# Altium schematic sheet АСТА.425543.043 Э3 Лист1.SchDoc
size 420 x 297 mm; Revision: 1; PageSetup: Record=PageOptions|CenterHorizontal=True|CenterVertical=True|PrintScale=0.96|XCorrection=1.00|YCorrection=1.00|PrintKind=1|BorderSize=5000000|LeftOffset=0|BottomOffset=0|Orientation=2|PaperLength=1000|PaperWidth=1000|Scale=100|PaperSource=7|PrintQuality=-4|MediaType=1|DitherType=10|PaperKind=A3|PrintScaleMode=1
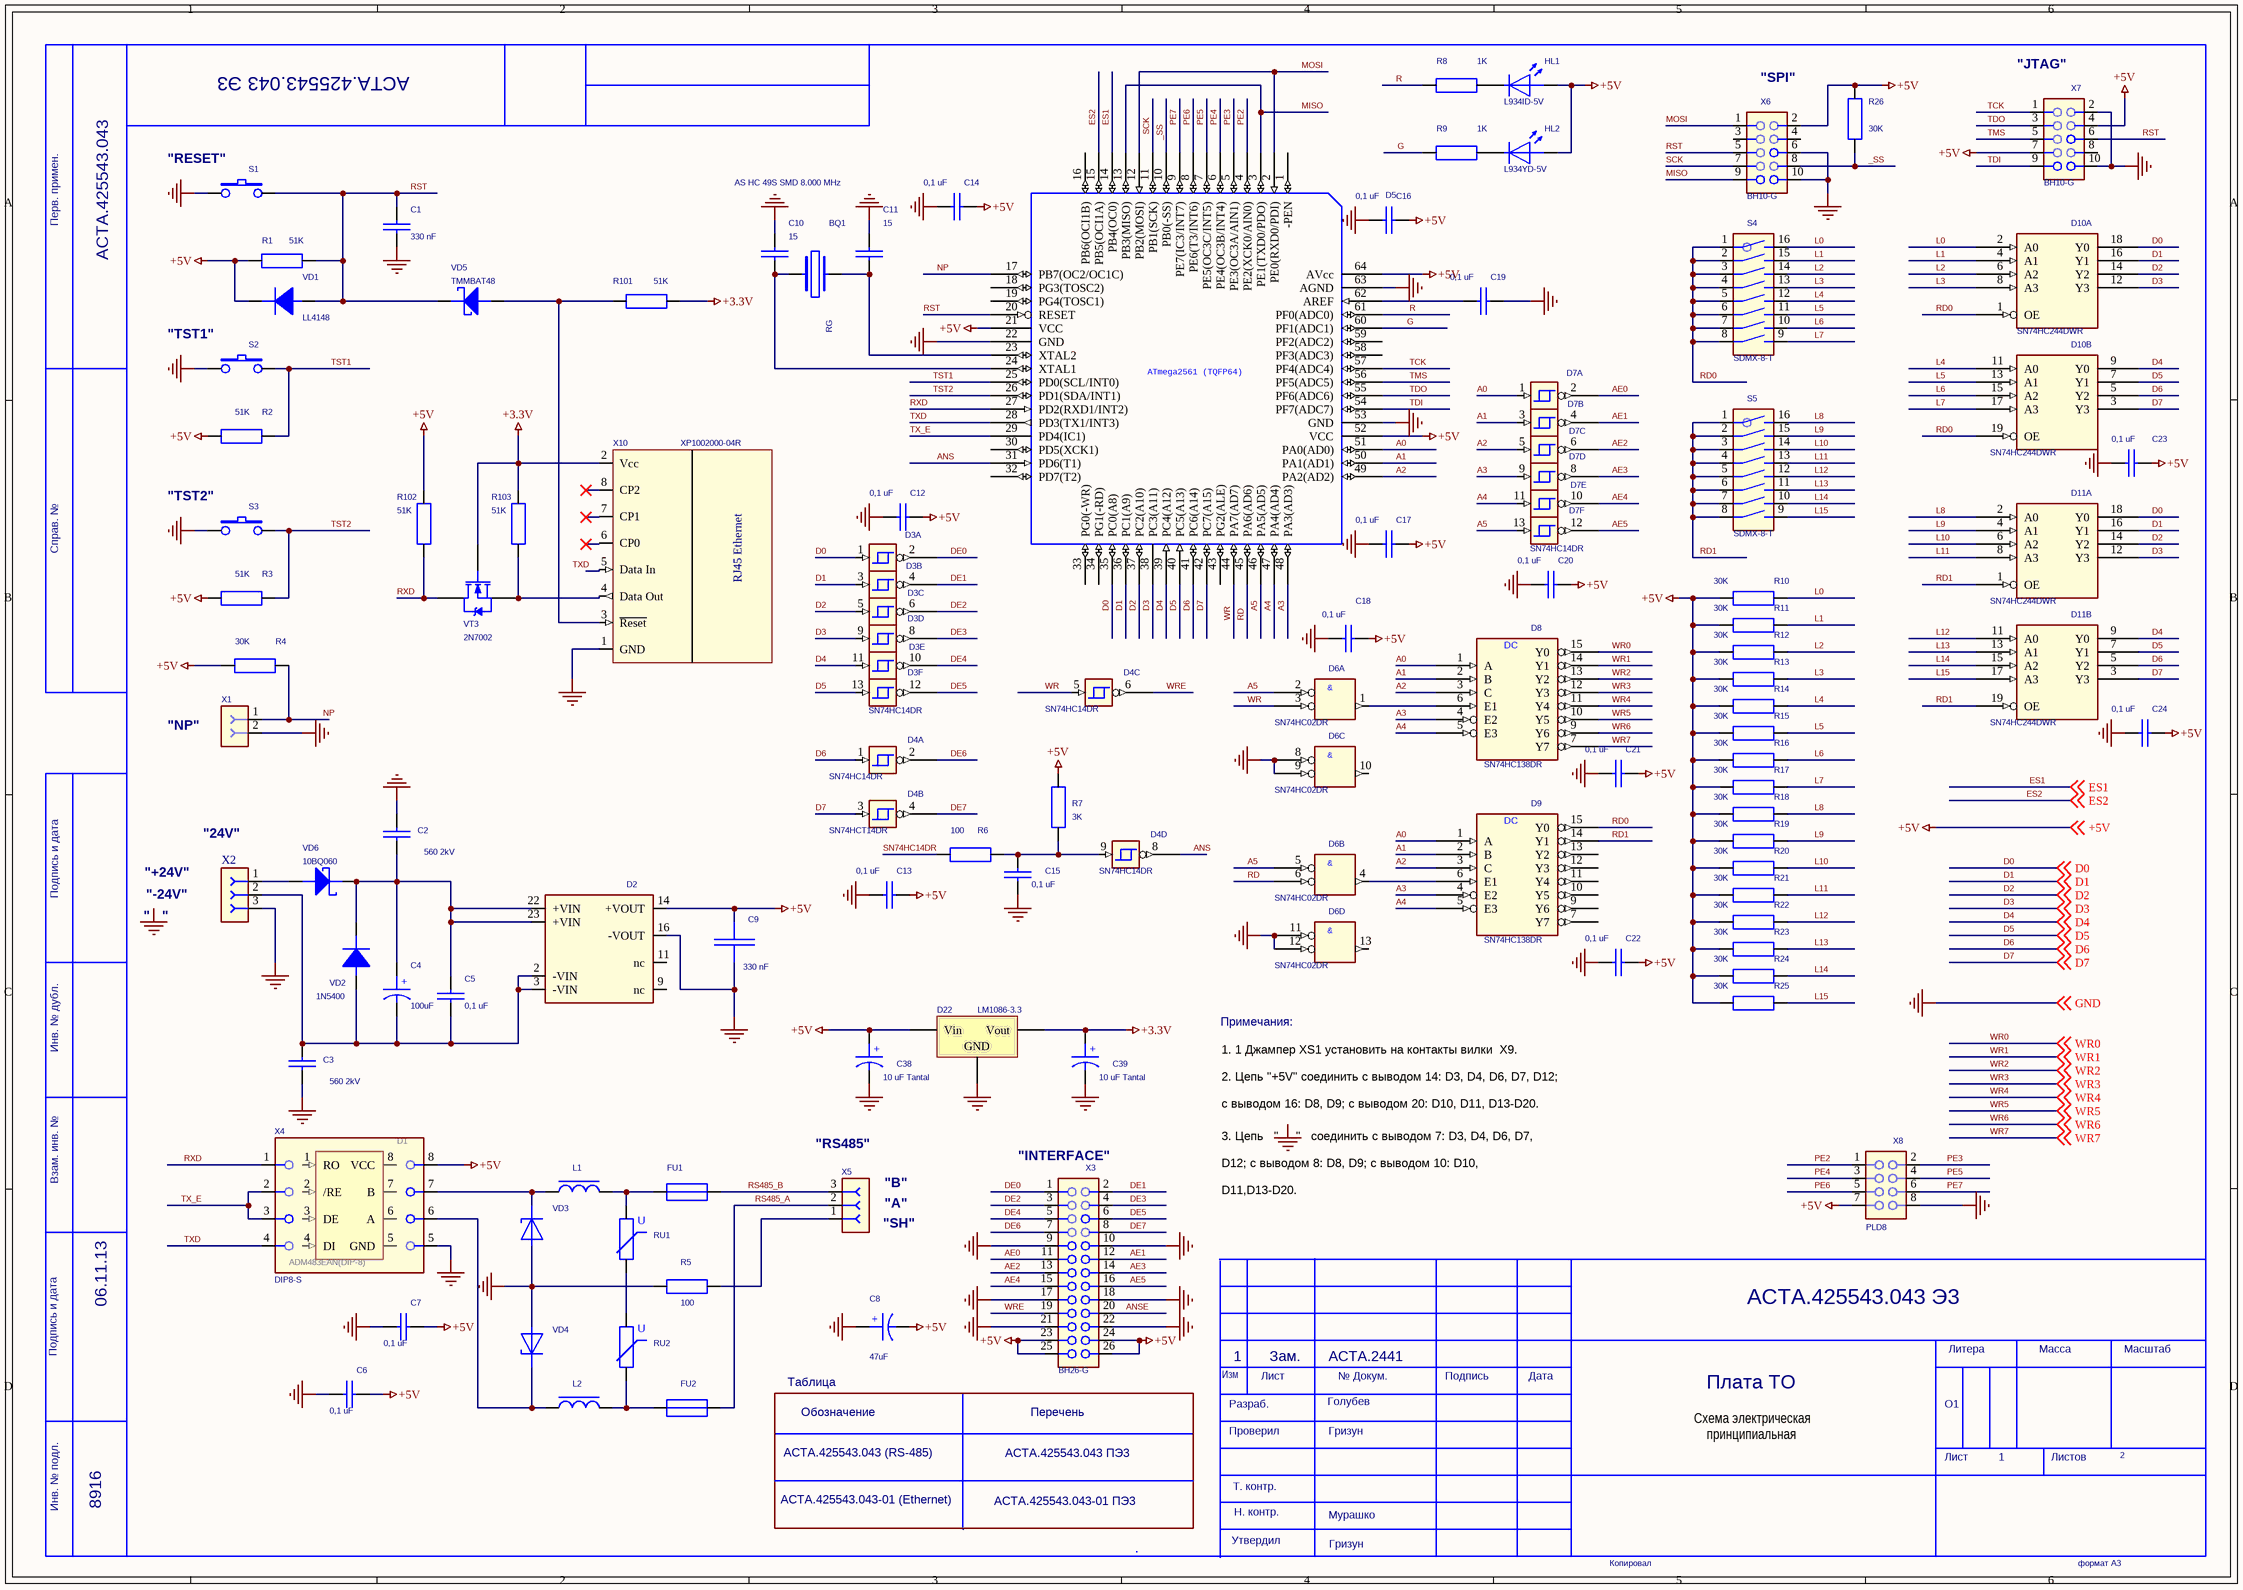
[diagram p0: АСТА.425543.043 Э3 Лист1.SchDoc]

## Parts
BQ1  AS HC 49S SMD 8.000 MHz  TYP: RG  [RG05.PRT]
C1  330 nF  [1206.PRT]
C2  560 2kV  [1206.PRT]
C3  560 2kV  [1206.PRT]
C4  100uF
C5  0,1 uF  [1206.PRT]
C6  0,1 uF  [1206.PRT]
C7  0,1 uF  [1206.PRT]
C8  47uF
C9  330 nF
C10  15  [1206.PRT]
C11  15  [1206.PRT]
C12  0,1 uF  [1206.PRT]
C13  0,1 uF  [1206.PRT]
C14  0,1 uF  [1206.PRT]
C15  0,1 uF  [1206.PRT]
C16  0,1 uF  [1206.PRT]
C17  0,1 uF  [1206.PRT]
C18  0,1 uF  [1206.PRT]
C19  0,1 uF  [1206.PRT]
C20  0,1 uF  [1206.PRT]
C21  0,1 uF  [1206.PRT]
C22  0,1 uF  [1206.PRT]
C23  0,1 uF  [1206.PRT]
C24  0,1 uF  [1206.PRT]
C38  10 uF Tantal
C39  10 uF Tantal
D1  ADM483EAN(DIP-8)  [DIP8.PRT]
D2  AM8T-2405SC  (value not drawn)
D3  SN74HCT14DR  (value not drawn)  (parts A,B,C,D,E,F of 6)
D4  SN74HC14DR  (parts A,B,C,D of 6)
D5  ATmega2561 (TQFP64)  [DIP40.PRT]  (value not drawn)
D6  SN74HC02DR  (parts A,B,C,D of 4)
D7  SN74HCT14DR  (value not drawn)  (parts A,B,C,D,E,F of 6)
D8  SN74HC138DR
D9  SN74HC138DR
D10  SN74HC244DWR  (parts A,B of 2)
D11  SN74HC244DWR  (parts A,B of 2)
D22  LM1086-3.3  [D2PAK_N]
FU1  TR5 Fast 0,2A  [FUSE.PRT]  (value not drawn)
FU2  TR5 Fast 0,2A  [FUSE.PRT]  (value not drawn)
HL1  L934ID-5V
HL2  L934YD-5V
L1  10uH  [L16D6,6d0,8]  (value not drawn)
L2  10uH  [L16D6,6d0,8]  (value not drawn)
R1  51K  [1206.PRT]
R2  51K  [1206.PRT]
R3  51K  [1206.PRT]
R4  30K  [1206.PRT]
R5  100  [1206.PRT]
R6  100  [1206.PRT]
R7  3K  [1206.PRT]
R8  1K  [1206.PRT]
R9  1K  [1206.PRT]
R10  30K  [1206.PRT]
R11  30K  [1206.PRT]
R12  30K  [1206.PRT]
R13  30K  [1206.PRT]
R14  30K  [1206.PRT]
R15  30K  [1206.PRT]
R16  30K  [1206.PRT]
R17  30K  [1206.PRT]
R18  30K  [1206.PRT]
R19  30K  [1206.PRT]
R20  30K  [1206.PRT]
R21  30K  [1206.PRT]
R22  30K  [1206.PRT]
R23  30K  [1206.PRT]
R24  30K  [1206.PRT]
R25  30K  [1206.PRT]
R26  30K  [1206.PRT]
R101  51K  [1206.PRT]
R102  51K  [1206.PRT]
R103  51K  [1206.PRT]
RU1  CN1812L8G  [D4x12 d1]  (value not drawn)
RU2  CN1812L8G  [D4x12 d1]  (value not drawn)
S1  0743  (value not drawn)
S2  0612  (value not drawn)
S3  0612  (value not drawn)
S4  SDMX-8-T
S5  SDMX-8-T
VD1  LL4148
VD2  1N5400
VD3  BZW06  [SOD6]  (value not drawn)
VD4  BZW06  [SOD6]  (value not drawn)
VD5  TMMBAT48
VD6  10BQ060
VT3  2N7002  [TO-220AB]
X1  EXTEND_21  (value not drawn)
X2  EXTEND_18  (value not drawn)
X3  BH26-G
X4  DIP8-S
X5  EXTEND_18  (value not drawn)
X6  BH10-G
X7  BH10-G
X8  PLD8
X10  XP1002000-04R

## Nets
+3.3V: C39.1 D22.3(Vout) R101.1 R103.1 VT3.1(G) X10.2(Vcc)
+5V: C6.2 C7.2 C8.2 C9.2 C12.2 C13.2 C14.2 C16.2 C17.2 C18.2 C20.2 C21.2 C22.2 C23.2 C24.2 C38.1 D2.14(+VOUT) D5.21(VCC) D5.52(VCC) D5.64(AVcc) D22.1(Vin) HL1.1(ANODE) HL2.1(ANODE) R1.2 R2.2 R3.2 R4.1 R7.2 R10.2 R11.2 R12.2 R13.2 R14.2 R15.2 R16.2 R17.2 R18.2 R19.2 R20.2 R21.2 R22.2 R23.2 R24.2 R25.2 R26.2 R102.1 VD1.C X3.23 X3.24 X3.25 X3.26 X4.8 X6.2 X7.4 X7.7 X8.7 ; off-sheet +5V
GND: C1.2 C2.1 C3.2 C6.1 C7.1 C8.1 C9.1 C10.2 C11.2 C12.1 C13.1 C14.1 C15.2 C16.1 C17.1 C18.1 C19.2 C20.1 C21.1 C22.1 C23.1 C24.1 C38.2 C39.2 D2.16(-VOUT) D3.7(GND) D3.GND D4.7(GND) D4.GND D5.22(GND) D5.53(GND) D5.63(AGND) D6.7(GND) D6.8(I0) D6.9(I1) D6.11(I0) D6.12(I1) D7.7(GND) D7.GND D8.8(GND) D9.8(GND) D10.10(GND) D11.10(GND) D22.2(GND) R5.2 S1.1 S2.1 S3.1 VD3.1 VD4.1 X1.2 X2.3 X3.9 X3.10 X3.17 X3.18 X3.21 X3.22 X4.5 X6.6 X6.10 X7.2 X7.10 X8.8 X10.1(GND) ; off-sheet GND
VCC: D3.14(VCC) D3.VCC D4.14(VCC) D4.VCC D6.14(VCC) D7.14(VCC) D7.VCC D8.16(VCC) D9.16(VCC) D10.20(VCC) D11.20(VCC)
_SS: D5.10(PB0(-SS)) R26.1 X6.8
A0: D5.51(PA0(AD0)) D7.1(I) D8.1(A) D9.1(A)
A1: D5.50(PA1(AD1)) D7.3(I) D8.2(B) D9.2(B)
A2: D5.49(PA2(AD2)) D7.5(I) D8.3(C) D9.3(C)
A3: D5.48(PA3(AD3)) D7.9(I) D8.4(E2) D9.4(E2)
A4: D5.47(PA4(AD4)) D7.11(I) D8.5(E3) D9.5(E3)
A5: D5.46(PA5(AD5)) D6.2(I0) D6.5(I0) D7.13(I)
AE0: D7.2(O) X3.11
AE1: D7.4(O) X3.12
AE2: D7.6(O) X3.13
AE3: D7.8(O) X3.14
AE4: D7.10(O) X3.15
AE5: D7.12(O) X3.16
ANS: D4.8(O) D5.31(PD6(T1))
ANSE: X3.20
D0: D3.1(I) D5.35(PC0(A8)) D10.18(Y0) D11.18(Y0) ; off-sheet D0
D1: D3.3(I) D5.36(PC1(A9)) D10.16(Y1) D11.16(Y1) ; off-sheet D1
D2: D3.5(I) D5.37(PC2(A10)) D10.14(Y2) D11.14(Y2) ; off-sheet D2
D3: D3.9(I) D5.38(PC3(A11)) D10.12(Y3) D11.12(Y3) ; off-sheet D3
D4: D3.11(I) D5.39(PC4(A12)) D10.9(Y0) D11.9(Y0) ; off-sheet D4
D5: D3.13(I) D5.40(PC5(A13)) D10.7(Y1) D11.7(Y1) ; off-sheet D5
D6: D4.1(I) D5.41(PC6(A14)) D10.5(Y2) D11.5(Y2) ; off-sheet D6
D7: D4.3(I) D5.42(PC7(A15)) D10.3(Y3) D11.3(Y3) ; off-sheet D7
DE0: D3.2(O) X3.1
DE1: D3.4(O) X3.2
DE2: D3.6(O) X3.3
DE3: D3.8(O) X3.4
DE4: D3.10(O) X3.5
DE5: D3.12(O) X3.6
DE6: D4.2(O) X3.7
DE7: D4.4(O) X3.8
ES1: D5.14(PB4(OC0)) ; off-sheet ES1
ES2: D5.15(PB5(OCI1A)) ; off-sheet ES2
G: D5.60(PF1(ADC1)) R9.1
L0: D10.2(A0) R10.1 S4.16
L1: D10.4(A1) R11.1 S4.15
L2: D10.6(A2) R12.1 S4.14
L3: D10.8(A3) R13.1 S4.13
L4: D10.11(A0) R14.1 S4.12
L5: D10.13(A1) R15.1 S4.11
L6: D10.15(A2) R16.1 S4.10
L7: D10.17(A3) R17.1 S4.9
L8: D11.2(A0) R18.1 S5.16
L9: D11.4(A1) R19.1 S5.15
L10: D11.6(A2) R20.1 S5.14
L11: D11.8(A3) R21.1 S5.13
L12: D11.11(A0) R22.1 S5.12
L13: D11.13(A1) R23.1 S5.11
L14: D11.15(A2) R24.1 S5.10
L15: D11.17(A3) R25.1 S5.9
MISO: D5.3(PE1(TXD0/PDO)) D5.13(PB3(MISO)) X6.9
MOSI: D5.2(PE0(RXD0/PDI)) D5.12(PB2(MOSI)) X6.1
NP: D5.17(PB7(OC2/OC1C)) R4.2 X1.1
PE2: D5.4(PE2(XCK0/AIN0)) X8.1
PE3: D5.5(PE3(OC3A/AIN1)) X8.2
PE4: D5.6(PE4(OC3B/INT4)) X8.3
PE5: D5.7(PE5(OC3C/INT5)) X8.4
PE6: D5.8(PE6(T3/INT6)) X8.5
PE7: D5.9(PE7(IC3/INT7)) X8.6
R: D5.61(PF0(ADC0)) R8.1
RD: D5.45(PA6(AD6)) D6.6(I1)
RD0: D9.15(Y0) D10.1(OE) D10.19(OE) S4.1 S4.2 S4.3 S4.4 S4.5 S4.6 S4.7 S4.8
RD1: D9.14(Y1) D11.1(OE) D11.19(OE) S5.1 S5.2 S5.3 S5.4 S5.5 S5.6 S5.7 S5.8
RS485_A: FU2.1 X5.2
RS485_B: FU1.1 X5.3
RST: C1.1 D5.20(RESET) R1.1 S1.2 VD1.A VD5.CATHODE X6.5 X7.6
RXD: D5.27(PD2(RXD1/INT2)) R102.2 VT3.2(D) X4.1
SCK: D5.11(PB1(SCK)) X6.7
SN74HC14DR: R6.2
TCK: D5.57(PF4(ADC4)) X7.1
TDI: D5.54(PF7(ADC7)) X7.9
TDO: D5.55(PF6(ADC6)) X7.3
TMS: D5.56(PF5(ADC5)) X7.5
TST1: D5.25(PD0(SCL/INT0)) R2.1 S2.2
TST2: D5.26(PD1(SDA/INT1)) R3.1 S3.2
TX_E: D5.29(PD4(IC1)) X4.2 X4.3
TXD: D5.28(PD3(TX1/INT3)) X4.4
WR: D4.5(I) D5.44(PA7(AD7)) D6.3(I1)
WR0: D8.15(Y0) ; off-sheet WR0
WR1: D8.14(Y1) ; off-sheet WR1
WR2: D8.13(Y2) ; off-sheet WR2
WR3: D8.12(Y3) ; off-sheet WR3
WR4: D8.11(Y4) ; off-sheet WR4
WR5: D8.10(Y5) ; off-sheet WR5
WR6: D8.9(Y6) ; off-sheet WR6
WR7: D8.7(Y7) ; off-sheet WR7
WRE: D4.6(O) X3.19
NetBQ1_1: BQ1.1 C10.1 D5.24(XTAL1)
NetBQ1_2: BQ1.2 C11.1 D5.23(XTAL2)
NetC2_2: C2.2 C4.1 C5.1 D2.22(+VIN) D2.23(+VIN) VD2.C VD6.CATHODE
NetC3_1: C3.1 C4.2 C5.2 D2.2(-VIN) D2.3(-VIN) VD2.A X2.2
NetC15_1: C15.1 D4.9(I) R6.1 R7.1
NetC19_1: C19.1 D5.62(AREF)
NetD6_1: D6.1(O) D8.6(E1)
NetD6_4: D6.4(O) D9.6(E1)
NetFU1_2: FU1.2 L1.2 RU1.1
NetFU2_2: FU2.2 L2.2 RU2.2
NetHL1_2: HL1.2(CATHODE) R8.2
NetHL2_2: HL2.2(CATHODE) R9.2
NetL1_1: L1.1 VD3.2 X4.7
NetL2_1: L2.1 VD4.2 X4.6
NetR5_1: R5.1 X5.1
NetR101_2: R101.2 VD5.ANODE X10.3(~{Reset})
NetR103_2: R103.2 VT3.3(S) X10.4(Data_Out)
NetRU1_2: RU1.2 RU2.1
NetVD6_ANODE: VD6.ANODE X2.1

Not connected (* = marked no-connect by the designer): D1 1(RO) 2(/RE) 3(DE) 4(DI) 5(GND) 6(A) 7(B) 8(VCC); D2 9(nc) 11(nc); D5 1(-PEN) 16(PB6(OCI1B)) 18(PG3(TOSC2)) 19(PG4(TOSC1)) 30(PD5(XCK1)) 32(PD7(T2)) 33(PG0(-WR)) 34(PG1(-RD)) 43(PG2(ALE)) 58(PF3(ADC3)) 59(PF2(ADC2)); D6 10(O) 13(O); D9 7(Y7) 9(Y6) 10(Y5) 11(Y4) 12(Y3) 13(Y2); X6 3 4; X7 8; X10 5(Data_In) 6(CP0) 7(CP1)* 8(CP2)*

## Notes on the sheet
- АСТА.425543.043 Э3
- "SPI"
- (near X7) "JTAG"
- (near S1) "RESET"
- Перв. примен.
- АСТА.425543.043
- (near S2) "TST1"
- (near S3) "TST2"
- Справ. №
- "NP"
- (near X2) "24V"
- Подпись и дата
- "   "
- "+24V"
- "-24V"
- Инв. № дубл.
- Примечания:
- (near R25) 1. 1 Джампер XS1 установить на контакты вилки  Х9.
- 2. Цепь "+5V" соединить с выводом 14: D3, D4, D6, D7, D12;
  с выводом 16: D8, D9; с выводом 20: D10, D11, D13-D20.
- Взам. инв. №
- (near X5) "RS485"
- (near X5) "A"
- (near X5) "B"
- (near X3) "INTERFACE"
- 3. Цепь   "     "   соединить с выводом 7: D3, D4, D6, D7,
  D12; с выводом 8: D8, D9; с выводом 10: D10,
  D11,D13-D20.
- (near X5) "SH"
- 06.11.13
- Таблица
- Изм
- Разраб.
- 1       Зам.       АСТА.2441
- Лист
- Голубев
- № Докум.
- Подпись
- Дата
- Плата ТO
- О1
- Литера
- Масса
- Масштаб
- АСТА.425543.043 (RS-485)
- Обозначение
- АСТА.425543.043 ПЭ3
- (near X3) Перечень
- Проверил
- Гризун
- Схема электрическая
  принципиальная
- 1
- Листов
- 2
- Инв. № подл.
- 8916
- АСТА.425543.043-01 (Ethernet)
- АСТА.425543.043-01 ПЭ3
- Утвердил
- Т. контр.
- Н. контр.
- Мурашко
- Копировал
- формат А3
- Labels drawn without touching a wire or pin: GND, TXD
- (in symbol 7402_3, part A) &
- (in symbol 7402_3, part B) &
- (in symbol 7402_3, part C) &
- (in symbol 7402_3, part D) &
- (in symbol 74138_0) DC
- (in symbol CAPACITOR POL_0) +
- (in symbol VAR) U
- (in symbol XPORT) RJ45 Ethernet

## Library data of the parts
BQ1 = QUARTZ: Specif: PK; TR: -; PRT: -; PAK: -; PC: -; NOTE: -; U: -
C1 C5 C15 = CHIP-C: Specif: MVS-SMD Z5U 50V 470pF 0805
C2 C3 = CHIP-C: Specif: SMD X7R 560pF 2kV 20% 1812
C4 C8 C38 C39 = CAPACITOR POL_0
C6 C7 C10-C14 C16-C24 = CHIP-C: Specif: SMD NP0 50V 15pF  10%  0805
C9 = kond_0
D1 = ADM485_5
D2 = P6_1
D3 D4 D7 = 14069_5
D5 = 80C51_12
D6 = 7402_3
D8 D9 = 74138_0
D10 D11 = 74HC244_0
D22 = Volt Reg: Voltage Regulator; Published: 24-Mar-1999; LatestRevisionDate: 29-May-2009; LatestRevisionNote: IPC-7351 Footprint Added.; PackageReference: D2PAK; Publisher: Altium Limited; PackageDescription: 3-Pin Transistor Outline Package 2.54 mm Pitch, 15.1 mm Lead Span
FU1 FU2 = FUSE: Specif: 165.050
HL1 HL2 = AL307AM
L1 L2 = L: Specif: 77A-151M
R1-R3 R10-R26 R101-R103 = CHIP-R: Specif: Chip RC 11 SMD 5%
R4 R6 = CHIP-R: Specif: Chip RC 01 SMD 5%
R5 R7-R9 = CHIP-R: Specif: RC 11 SMD 5%
RU1 RU2 = VAR: Specif: RC 01 SMD 5%
S1-S3 = SW PUSHBUTTON_0
S4 S5 = EXTEND_3
VD1 VD2 = P6KE12_0
VD3 VD4 = BI TRANSIL_1
VD5 VD6 = DIODE SCHOTTKY_0
VT3 = NMOS-2: N-Channel Power MOSFET; Note: Pin 2 is electrically connected to pin 4.; Published: 8-Jun-2000; LatestRevisionDate: 17-Jul-2002; LatestRevisionNote: Re-released for DXP Platform.; DatasheetVersion: PD-9.814; PackageVersion: Feb-1997; PackageReference: TO-220AB; Publisher: Altium Limited; PackageDescription: TO, Thru-Hole, Vertical, Heatsink Mounted; 3 In-Line Leads; Pitch 2.54 mm; ComponentLink1Description: Manufacturer Link; ComponentLink1URL: http://www.irf.com/
X3 = EXTEND_20
X4 = EXTEND_28
X6 X7 = EXTEND_1
X8 = EXTEND_25
X10 = XPORT: Value: XP1002000-04R